# EAGLE schematic M668X (EAGLE 6.6.0)
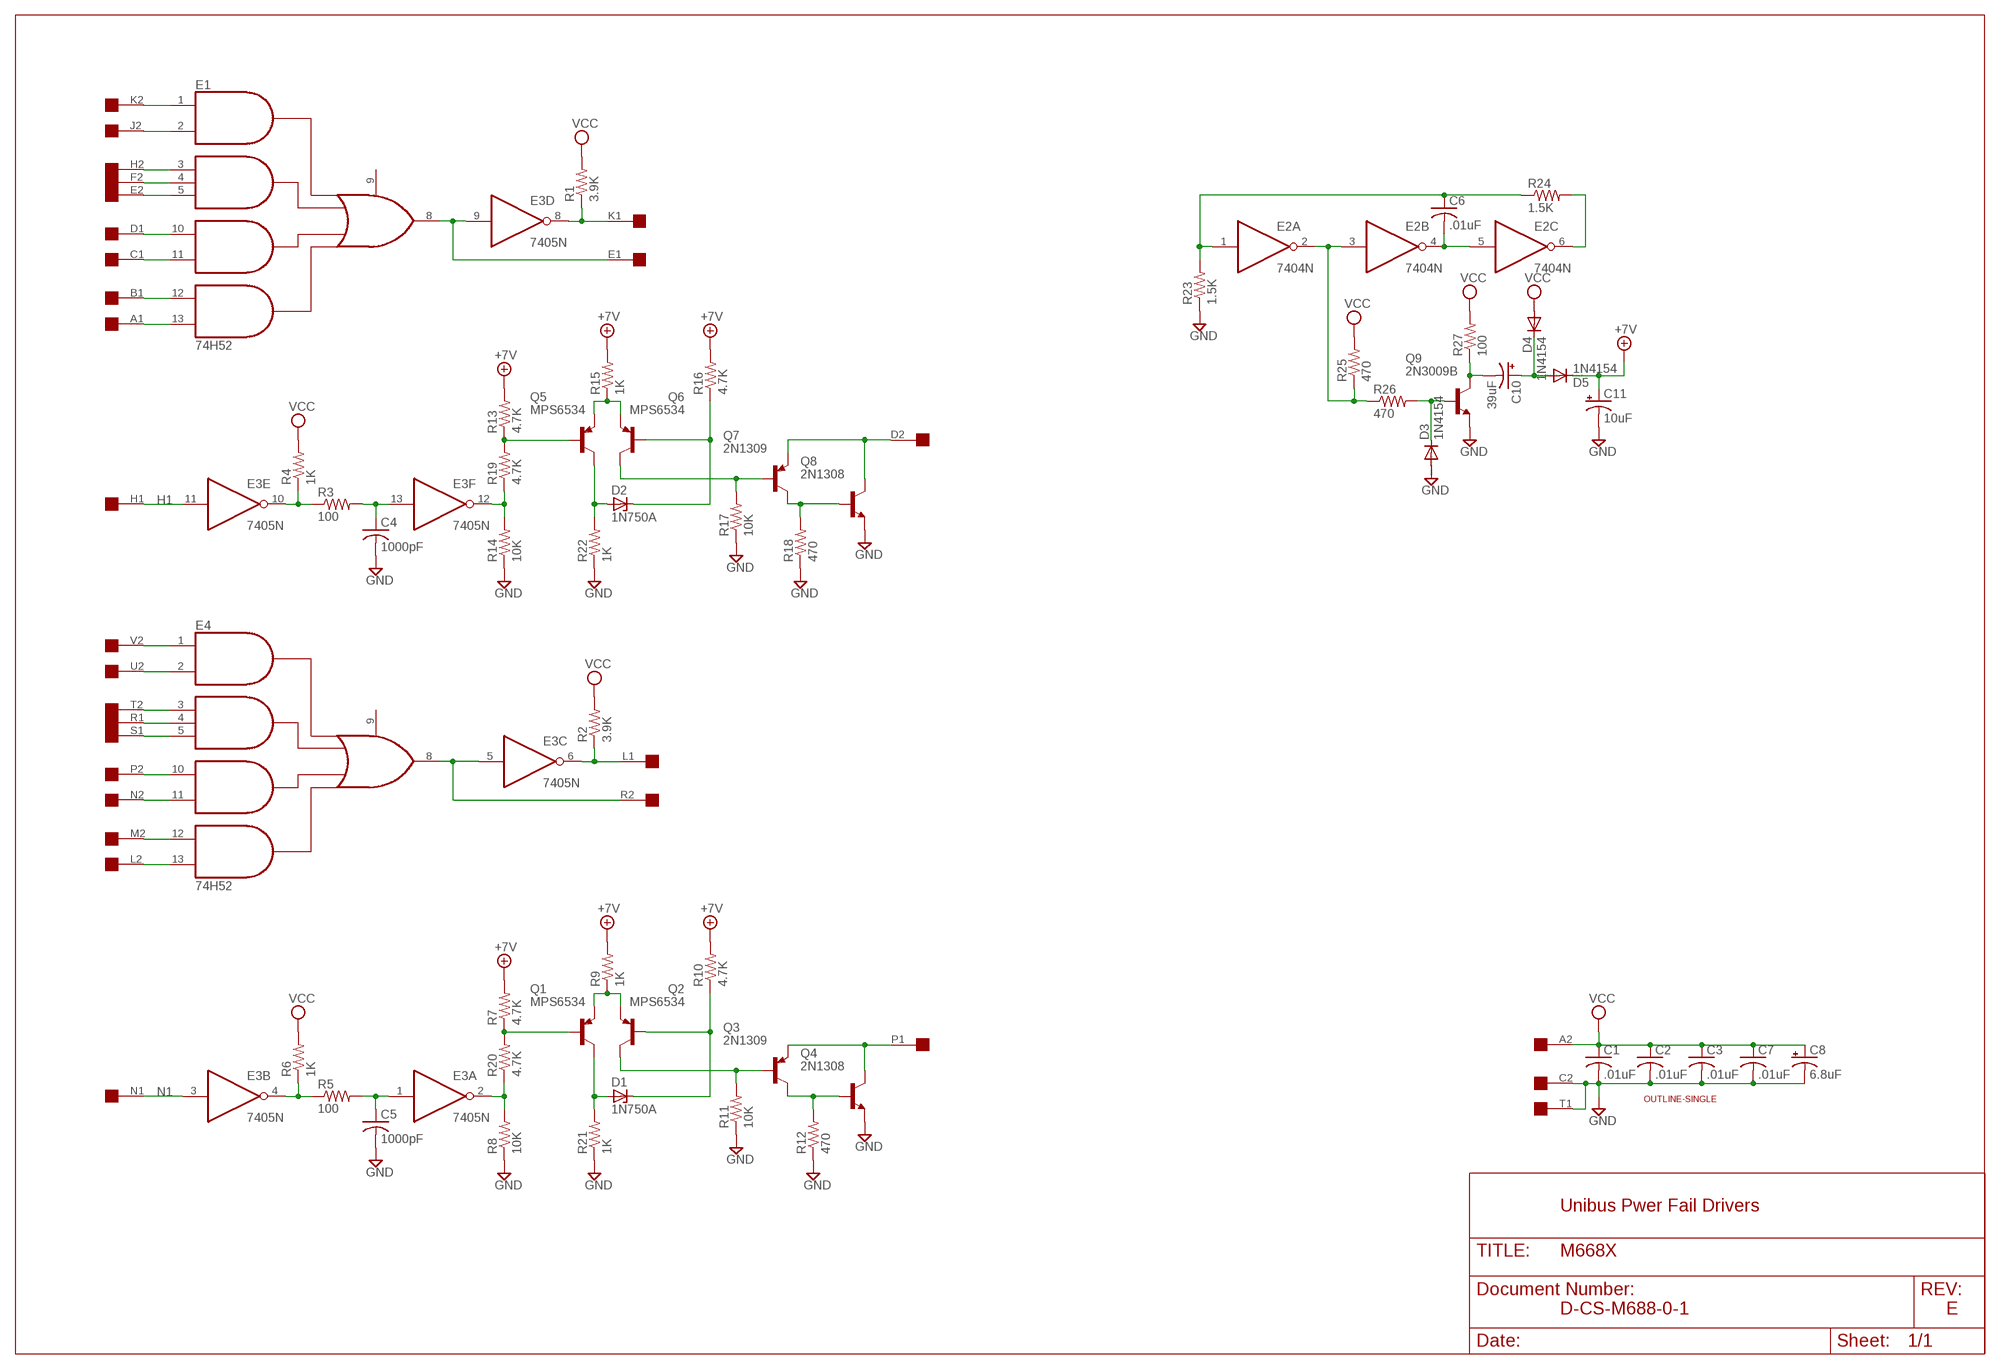
[diagram p0: schematic, sheet 1]

## Parts
C1  .01uF  C-US050-025X075  [C050-025X075]
C2  .01uF  C-US050-025X075  [C050-025X075]
C3  .01uF  C-US050-025X075  [C050-025X075]
C4  1000pF  C-US050-025X075  [C050-025X075]
C5  1000pF  C-US050-025X075  [C050-025X075]
C6  .01uF  C-US050-025X075  [C050-025X075]
C7  .01uF  C-US050-025X075  [C050-025X075]
C8  6.8uF  CPOL-USE20-8AXIAL  [E12-8]
C10  39uF  CPOL-USE20-8AXIAL  [E12-8]
C11  10uF  CPOL-USE20-8AXIAL  [E12-8]
D1  1N750A  ZENER-DIODEDO35Z10  [DO35Z10]
D2  1N750A  ZENER-DIODEDO35Z10  [DO35Z10]
D3  1N4154  DIODE-DO35-10  [DO35-10]
D4  1N4154  DIODE-DO35-10  [DO35-10]
D5  1N4154  DIODE-DO35-10  [DO35-10]
E1  74H52  [DIL14]
E2  7404N  [DIL14]
E3  7405N  [DIL14]
E4  74H52  [DIL14]
Q1  MPS6534  -PNP-TO5  [TO5]
Q2  MPS6534  -PNP-TO5  [TO5]
Q3  2N1309  -PNP-TO5  [TO5]
Q4  2N1308  -NPN-TO5  [TO5]
Q5  MPS6534  -PNP-TO5  [TO5]
Q6  MPS6534  -PNP-TO5  [TO5]
Q7  2N1309  -PNP-TO5  [TO5]
Q8  2N1308  -NPN-TO5  [TO5]
Q9  2N3009B  -NPN-TO5  [TO5]
R1  3.9K  R-US_0207/10  [0207/10]
R2  3.9K  R-US_0207/10  [0207/10]
R3  100  R-US_0207/10  [0207/10]
R4  1K  R-US_0207/10  [0207/10]
R5  100  R-US_0207/10  [0207/10]
R6  1K  R-US_0207/10  [0207/10]
R7  4.7K  R-US_0207/10  [0207/10]
R8  10K  R-US_0207/10  [0207/10]
R9  1K  R-US_0207/10  [0207/10]
R10  4.7K  R-US_0207/10  [0207/10]
R11  10K  R-US_0207/10  [0207/10]
R12  470  R-US_0207/10  [0207/10]
R13  4.7K  R-US_0207/10  [0207/10]
R14  10K  R-US_0207/10  [0207/10]
R15  1K  R-US_0207/10  [0207/10]
R16  4.7K  R-US_0207/10  [0207/10]
R17  10K  R-US_0207/10  [0207/10]
R18  470  R-US_0207/10  [0207/10]
R19  4.7K  R-US_0207/10  [0207/10]
R20  4.7K  R-US_0207/10  [0207/10]
R21  1K  R-US_0207/10  [0207/10]
R22  1K  R-US_0207/10  [0207/10]
R23  1.5K  R-US_0207/10  [0207/10]
R24  1.5K  R-US_0207/10  [0207/10]
R25  470  R-US_0207/10  [0207/10]
R26  470  R-US_0207/10  [0207/10]
R27  100  R-US_0207/10  [0207/10]
U$1  OUTLINE-SINGLE  [SINGLE]
U$2  SINGLE  [EDGE-CON2]

## Nets
+7V [supply]: C11.+ D5.C R7.2 R9.2 R10.2 R13.2 R15.2 R16.2
B1: E1.12(I12) U$2.B1
C1: E1.11(I11) U$2.C1
D1: E1.10(I10) U$2.D1
D2: Q7.1(E) Q8.3(C) U$2.D2
E1: E1.8(O8) E3.9(D:I) U$2.E1
E2: E1.5(I5) U$2.E2
F2: E1.4(I4) U$2.F2
GND [supply]: C1.2 C2.2 C3.2 C4.2 C5.2 C7.2 C8.- C11.- D3.A Q4.1(E) Q8.1(E) Q9.1(E) R8.1 R11.1 R12.1 R14.1 R17.1 R18.1 R21.1 R22.1 R23.1 U$2.C2 U$2.T1
H1: E3.11(E:I) U$2.H1
H2: E1.3(I3) U$2.H2
J2: E1.2(I2) U$2.J2
K1: E3.8(D:O) R1.1 U$2.K1
K2: E1.1(I1) U$2.K2
L1: E3.6(C:O) R2.1 U$2.L1
L2: E4.12(I12) U$2.M2
M2: E4.13(I13) U$2.L2
N1: E3.3(B:I) U$2.N1
N2: E4.11(I11) U$2.N2
N$1: E1.13(I13) U$2.A1
N$2: E3.10(E:O) R3.1 R4.1
N$3: C4.1 E3.13(F:I) R3.2
N$4: Q5.2(B) R13.1 R19.2
N$5: E3.12(F:O) R14.2 R19.1
N$6: Q5.1(E) Q6.1(E) R15.1
N$7: D2.A Q5.3(C) R22.2
N$8: D2.C Q6.2(B) R16.1
N$9: Q6.3(C) Q7.2(B) R17.2
N$10: Q7.3(C) Q8.2(B) R18.2
N$11: E3.4(B:O) R5.1 R6.1
N$12: C5.1 E3.1(A:I) R5.2
N$13: Q1.2(B) R7.1 R20.2
N$14: E3.2(A:O) R8.2 R20.1
N$15: Q1.1(E) Q2.1(E) R9.1
N$16: D1.A Q1.3(C) R21.2
N$17: D1.C Q2.2(B) R10.1
N$18: Q2.3(C) Q3.2(B) R11.2
N$19: Q3.3(C) Q4.2(B) R12.2
N$20: E2.2(A:O) E2.3(B:I) R25.1 R26.1
N$21: C6.2 E2.4(B:O) E2.5(C:I)
N$22: C6.1 E2.1(A:I) R23.2 R24.1
N$23: E2.6(C:O) R24.2
N$26: D3.C Q9.2(B) R26.2
N$27: C10.- Q9.3(C) R27.1
N$28: C10.+ D4.C D5.A
P1: Q3.1(E) Q4.3(C) U$2.P1
P2: E4.10(I10) U$2.P2
R1: E4.4(I4) U$2.R1
R2: E3.5(C:I) E4.8(O8) U$2.R2
S1: E4.5(I5) U$2.S1
T2: E4.3(I3) U$2.T2
U2: E4.2(I2) U$2.U2
V2: E4.1(I1) U$2.V2
VCC [supply]: C1.1 C2.1 C3.1 C7.1 C8.+ D4.A R1.2 R2.2 R4.2 R6.2 R25.2 R27.2 U$2.A2
Unconnected: E1.6(NC) E1.9(I9) E2.8(D:O) E2.9(D:I) E2.10(E:O) E2.11(E:I) E2.12(F:O) E2.13(F:I) E4.6(NC) E4.9(I9) U$2.B2 U$2.F1 U$2.J1 U$2.M1 U$2.S2 U$2.U1 U$2.V1

## Notes on the sheet
- Unibus Pwer Fail Drivers
- D-CS-M688-0-1 | E

## Power pins joined to a net without a drawn wire
GND: E1.7(GND) E2.7(P:GND) E3.7(P:GND) E4.7(GND)
VCC: E1.14(VCC) E2.14(P:VCC) E3.14(P:VCC) E4.14(VCC)

## Library data of the parts
C1-C7 = rcl:C-US: CAPACITOR, American symbol
C8 C10 C11 = dec-con:CPOL-USE20-8AXIAL: A 0.8 inch electrolytic.
D1 D2 = diode:ZENER-DIODE: Z-Diode
D3-D5 = diode:DIODE-: DIODE
E1 E4 = dec-con:74*52: Expandable 2-2-2-3 Input AND-OR gate.
E2 = 74xx-us:74*04: Hex INVERTER
E3 = 74xx-us:74*05: Hex INVERTER, open collector
Q1-Q3 Q5-Q7 = transistor:*-PNP-: PNP Transistror
Q4 Q8 Q9 = transistor:*-NPN-: NPN Transistror BF959 corrected 2008.03.06
R1-R27 = rcl:R-US_: RESISTOR, American symbol
U$1 = dec-con:OUTLINE-*: Board outlines for DEC boards.
U$2 = dec-con:SINGLE: Single-Height DEC board

## Net classes
1 supply: width 0.813 mm